# Altium schematic sheet Accel.SchDoc
size A4
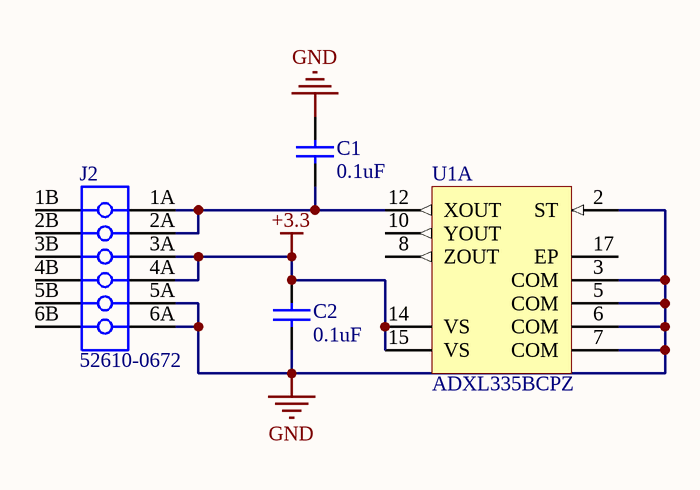
[diagram p0: Accel.SchDoc]

## Parts
C1  0.1uF  [CAPC3216X127X50NL20T25]
C2  0.1uF  [CAPC3216X127X50NL20T25]
J2  52610-0672  [MOLX-52610-0672]
U1  ADXL335BCPZ  [ADI-CP-16-14_M]  (part A of 2)

## Nets
+3.3: C2.2 J2.3A J2.4A U1.14(VS) U1.15(VS)
GND: C1.2 C2.1 J2.5A J2.6A U1.2(ST) U1.3(COM) U1.5(COM) U1.6(COM) U1.7(COM)
NetC1_1: C1.1 J2.1A J2.2A U1.12(XOUT)

Not connected (* = marked no-connect by the designer): J2 1B 2B 3B 4B 5B 6B; U1 8(ZOUT) 10(YOUT) 17(EP)

## Library data of the parts
C1 C2 = CMP-126765-1: CAP CER 0.1UF 100V 5% X7R 1206; Manufacturer Part Number: 12061C104JAT2A; CiivaID: 126765; Capacitance: 100 nF; Rated Voltage: 100 V; Dielectric: X7R; Case Size/Dimension: 1206; Tolerance (%): ±5 %; Ciiva URL: https://ciiva.com/part/12061c104jat2a-126765
J2 = CMP-1134601-2: 1.0 mm Pitch Easy-On(TM) Type FPC Connector, 5.75 mm Mated Height, Vertical, ZIF, SMT, 6 Circuits, -40 to 85 degC, ELV and RoHS Compliant, Tape and Reel; Current Rating: 0.5 A; Gender: Female; Glow Wire Compliant: Non-Compliant; Number of Circuits: 6; Contact Material: Phosphor Bronze; ELV Compliant: Compliant; Flammability Rating: UL 94 V-0; Halogen Free Status: Not Low Halogen; Lifecycle Status: Active; Material: Phosphor Bronze; Number of Contacts: 6; Number of Rows: 2; Octopart Url: https://octopart.com/52610-0672-molex-7645923; OctopartID: 6c58a6dfae90b39f; Orientation: Vertical; Packaging: Tape & Reel (TR); REACH SVHC Compliance: No SVHC; RoHS: Compliant
U1 = CMP-978105-2: Small, Low Power, 3-Axis +/-3 g Accelerometer with Analog Output, 1.6 KHz BW, Industrial, 16-pin QFN, Tray; Lead-Free Status: Contains Lead; Supply Current: 0.00035 A; Lifecycle Status: Active; Number of Pins: 16; Octopart Url: https://octopart.com/adxl335bcpz-analog+devices-10465913; OctopartID: a6da6f4f31c5791d; REACH SVHC Compliance: No SVHC; RoHS: Compliant